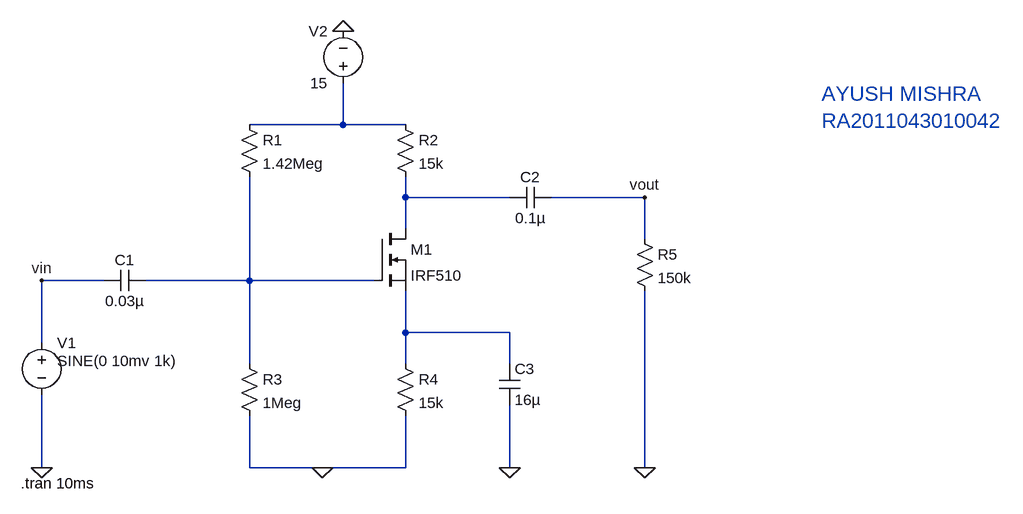
[diagram p0: schematic exp 2.asc]
exp 2.asc, the LTspice schematic file:
Version 4
SHEET 1 1356 680
WIRE 320 -240 320 -304
WIRE 320 -240 176 -240
WIRE 416 -240 320 -240
WIRE 416 -128 416 -160
WIRE 576 -128 416 -128
WIRE 784 -128 640 -128
WIRE 416 -80 416 -128
WIRE 784 -64 784 -128
WIRE -48 0 -144 0
WIRE 176 0 176 -160
WIRE 176 0 16 0
WIRE 368 0 176 0
WIRE 416 80 416 16
WIRE 576 80 416 80
WIRE -144 96 -144 0
WIRE 176 128 176 0
WIRE 416 128 416 80
WIRE 576 128 576 80
WIRE -144 288 -144 176
WIRE 176 288 176 208
WIRE 288 288 176 288
WIRE 416 288 416 208
WIRE 416 288 288 288
WIRE 576 288 576 192
WIRE 784 288 784 16
FLAG 320 -384 0
FLAG -144 288 0
FLAG 288 288 0
FLAG 576 288 0
FLAG 784 288 0
FLAG -144 0 vin
FLAG 784 -128 vout
SYMBOL nmos 368 -80 R0
SYMATTR InstName M1
SYMATTR Value IRF510
SYMBOL res 160 -256 R0
SYMATTR InstName R1
SYMATTR Value 1.42Meg
SYMBOL res 400 -256 R0
SYMATTR InstName R2
SYMATTR Value 15k
SYMBOL res 160 112 R0
SYMATTR InstName R3
SYMATTR Value 1Meg
SYMBOL res 400 112 R0
SYMATTR InstName R4
SYMATTR Value 15k
SYMBOL res 768 -80 R0
SYMATTR InstName R5
SYMATTR Value 150k
SYMBOL voltage -144 80 R0
WINDOW 123 0 0 Left 0
WINDOW 39 0 0 Left 0
WINDOW 3 24 44 Left 2
SYMATTR InstName V1
SYMATTR Value SINE(0 10mv 1k)
SYMBOL voltage 320 -288 R180
WINDOW 0 24 96 Left 2
WINDOW 3 24 16 Left 2
WINDOW 123 0 0 Left 0
WINDOW 39 0 0 Left 0
SYMATTR InstName V2
SYMATTR Value 15
SYMBOL cap -48 16 R270
WINDOW 0 32 32 VTop 2
WINDOW 3 0 32 VBottom 2
SYMATTR InstName C1
SYMATTR Value 0.03µ
SYMBOL cap 576 -112 R270
WINDOW 0 32 32 VTop 2
WINDOW 3 0 32 VBottom 2
SYMATTR InstName C2
SYMATTR Value 0.1µ
SYMBOL cap 560 128 R0
SYMATTR InstName C3
SYMATTR Value 16µ
TEXT -176 312 Left 2 !.tran 10ms
TEXT 1056 -288 Left 3 ;AYUSH MISHRA \nRA2011043010042

The netlist it stands for:
* exp 2.asc
M1 N002 N003 N004 N004 IRF510
R1 N001 N003 1.42Meg
R2 N001 N002 15k
R3 N003 0 1Meg
R4 N004 0 15k
R5 vout 0 150k
V1 vin 0 SINE(0 10mv 1k)
V2 N001 0 15
C1 vin N003 0.03µ
C2 N002 vout 0.1µ
C3 N004 0 16µ
.model NMOS NMOS
.model PMOS PMOS
.lib standard.mos
.tran 10ms
* AYUSH MISHRA
* RA2011043010042
.backanno
.end